# Altium schematic sheet ADC.SCHDOC
size B
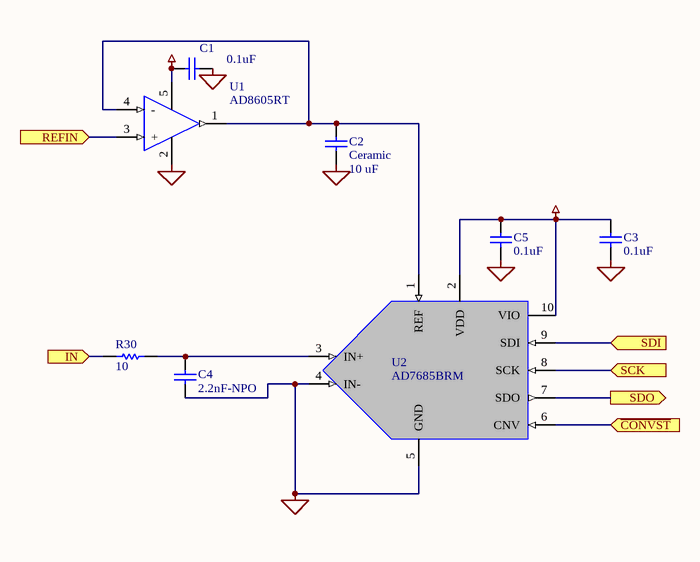
[diagram p0: ADC.SCHDOC]

## Parts
C1  value 0.1uF  [CC1608-0603]  (hidden comment: Cap)
C2  Ceramic  value 10 uF  [0805]
C3  value 0.1uF  [CC1608-0603]  (hidden comment: Cap)
C4  value 2.2nF-NPO  [0603]  (hidden comment: Cap)
C5  value 0.1uF  [CC1608-0603]  (hidden comment: Cap)
R30  value 10  [0603]  (hidden comment: Res1)
U1  AD8605RT  [SO-G5/P.95]
U2  AD7685BRM  [AD RM-10]

## Ports
IN (in), REFIN (in), SCK (in), SDI (in), SDO (out), ~{CONVST} (in)

## Nets
AGND: C1.2 C2.1 C3.1 C4.1 C5.1 U1.2(-Vs) U2.4(IN-) U2.5(GND)
AVDD: C1.1 C3.2 C5.2 U1.5(+Vs) U2.2(VDD) U2.10(VIO)
~{CONVST}: U2.6(CNV) ; port ~{CONVST}
IN: R30.1 ; port IN
REFIN: U1.3(+) ; port REFIN
SCK: U2.8(SCK) ; port SCK
SDI: U2.9(SDI) ; port SDI
SDO: U2.7(SDO) ; port SDO
NetC2_2: C2.2 U1.1(Out) U1.4(-) U2.1(REF)
NetC4_2: C4.2 R30.2 U2.3(IN+)

## Library data of the parts
C1 C3 C5 = Cap: Capacitor; Manufacturer: Generic Components; Class I: Passive; Published: 8-Jun-2000; Revision: July-2002: Re-released for DXP Platform.; Publisher: Altium Limited; Class II: Capacitor
C2 C4 = Cap: Capacitor; Published: 8-Jun-2000; LatestRevisionDate: 17-Jul-2002; LatestRevisionNote: Re-released for DXP Platform.; Publisher: Altium Limited
R30 = Res1: Resistor; Published: 8-Jun-2000; LatestRevisionDate: 17-Jul-2002; LatestRevisionNote: Re-released for DXP Platform.; Publisher: Altium Limited
U1 = AD8605RT: Analog Devices Precision Low Noise CMOS Rail-to-Rail Input/Output Operational Amplifier
U2 = AD7685: AD 16-bit 250 kSPS ADC; Vendor: Analog Devices